# EAGLE design Tag-Deconnector (EAGLE 9.4.2)
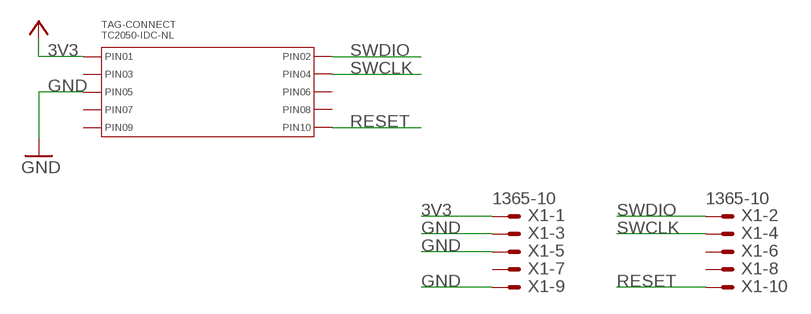
[diagram p0: schematic, sheet 1]

## Parts
TAG-CONNECT  TC2050-IDC-NL  CON_02X05_TC2050-IDC-NL  [TC2050-IDC-NL]
X1  1365-10  [1365-10]

## Nets
3V3: TAG-CONNECT.P$1(PIN1) X1.1 ; supply symbol labelled +3V3
GND: TAG-CONNECT.P$5(PIN5) X1.3 X1.5 X1.9
RESET: TAG-CONNECT.P$10(PIN10) X1.10
SWCLK: TAG-CONNECT.P$4(PIN4) X1.4
SWDIO: TAG-CONNECT.P$2(PIN2) X1.2
Unconnected: TAG-CONNECT.P$3(PIN3) TAG-CONNECT.P$6(PIN6) TAG-CONNECT.P$7(PIN7) TAG-CONNECT.P$8(PIN8) TAG-CONNECT.P$9(PIN9) X1.6 X1.7 X1.8

## Library data of the parts
TAG-CONNECT = MF_Connectors:CON_02X05: Library: MF_Connectors Description: Header Connector with 10 Positions and 02 Rows. Use the LABEL Attribute to label the pin on the schematic and PCB. You can remove the attributes on the PCB by using the SMASH function on the part and then deleting the text.; HOUSEPART: NO; MPN: TC2050-IDC-NL; POPULATE: 0; URL: http://www.tag-connect.com/Materials/TC2050-IDC-NL%20Datasheet.pdf
X1 = con-leotronics:1365-10: DUAL ROW STRAIGHT HEADER 1364 SERIES. 1.27mm x 1.27mm. Without Fixing Post. SMT Source: http://www.leotronics.co.uk/Conexcon/Data%20Sheets/sec.%20A/1364ing.pdf; OC_FARNELL: unknown; OC_NEWARK: unknown

## Board
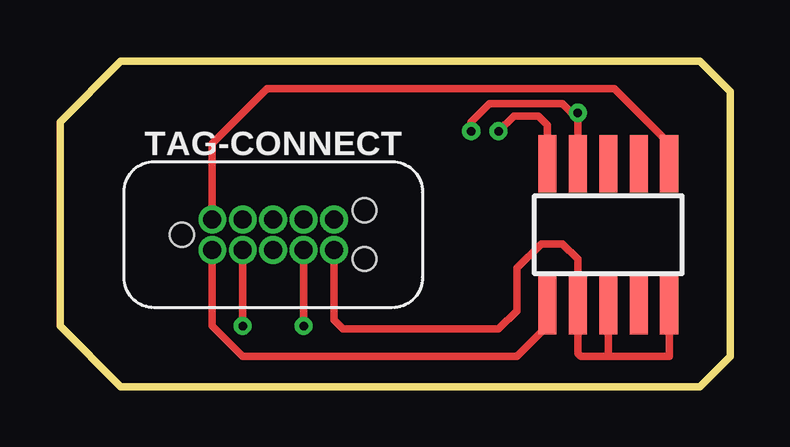
[diagram p1: board, top side]
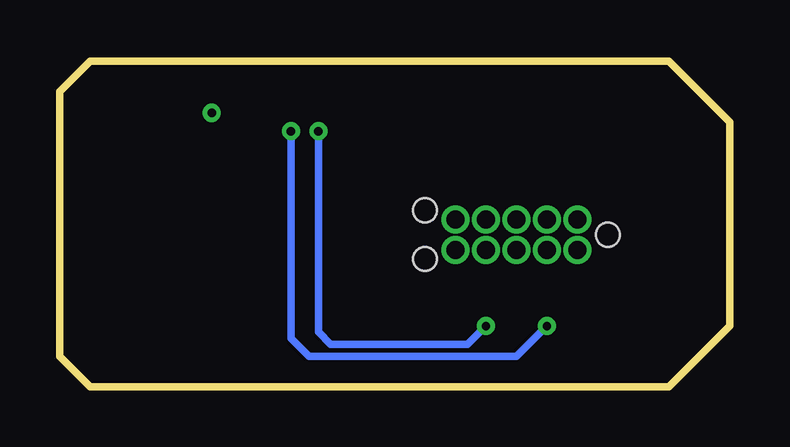
[diagram p2: board, bottom side, seen from below]

Size 27.92 x 13.64 mm. Coordinates in mm from the lower left corner, seen from the top.
Outline: 0,11.1 0,2.54 2.54,0 26.65,0 27.92,1.27 27.92,12.37 26.65,13.64 2.54,13.64 0,11.1
Copper layers (1*16): Top 0.035mm / dielectric 1.5mm / Bottom 0.035mm
Design rules "default": minimum track width 6mil, minimum drill 0.35mm, track to track 6mil, track to pad 6mil, pad to pad 6mil, via to via 6mil, smd to smd 6mil, copper to edge 40mil, drill to drill 6mil, minimum pad ring 10mil, minimum via ring 8mil, stop-mask expansion 4mil, vias tented up to drill 0mil, thermal gap 10mil
Milling: 8 lines

### Footprints (pad centres in the part's own frame; a part is rotated, then mirrored left to right if it is on the bottom)
TC2050-IDC-NL = smd 0.787 x 0.787: P$1 -2.54,-0.635; P$2 -1.27,-0.635; P$3 0,-0.635; P$4 1.27,-0.635; P$5 2.54,-0.635; P$6 2.54,0.635; P$7 1.27,0.635; P$8 0,0.635; P$9 -1.27,0.635; P$10 -2.54,0.635 | hole 0.991: 3.81,1.016; 3.81,-1.016; -3.81,0
1365-10 = smd 0.76 x 2.4: 1 -2.54,-2.95; 2 -2.54,2.95; 3 -1.27,-2.95; 4 -1.27,2.95; 5 0,-2.95; 6 0,2.95; 7 1.27,-2.95; 8 1.27,2.95; 9 2.54,-2.95; 10 2.54,2.95

### Placement (x,y rotation side)
TAG-CONNECT  8.89,6.35 0 top
X1  22.86,6.35 0 top

### Tracks (layer width: path | path; a pad name or v marks a point on that pad's centre or on a via)
3V3  (via drill 0.75)
  Top 0.305: TAG-CONNECT.P$1 6.35,2.54 7.62,1.27 19.05,1.27 20.32,2.54 X1.1
  other vias: 6.35,5.71
GND  (via drill 0.75)
  Top 0.305: 21.59,3.17 21.59,1.39 21.71,1.27 22.86,1.27 | 21.59,3.17 X1.3 | 22.86,1.27 X1.5 | 22.86,1.27 25.4,1.27 X1.9 | TAG-CONNECT.P$5 11.43,2.79 11.81,2.41 18.29,2.41 19.05,3.17 19.05,4.95 20.07,5.97 20.95,5.97 21.59,5.33 21.59,3.17
  other vias: 11.43,5.71
N$1  (via drill 0.75)
  other vias: 8.89,5.71
N$2  (via drill 0.75)
  other vias: 7.62,6.99
N$3  (via drill 0.75)
  other vias: 8.89,6.99
N$4  (via drill 0.75)
  other vias: 10.16,6.99
N$5  (via drill 0.75)
  other vias: 11.43,6.99
RESET  (via drill 0.75)
  Top 0.305: v6.35,6.99 6.35,10.16 8.64,12.45 23.11,12.45 25.4,10.16 X1.10
SWCLK  (via drill 0.35, 0.75)
  Top 0.305: TAG-CONNECT.P$4 v10.16,2.54 | X1.4 v21.59,11.43 21.34,11.43 20.95,11.81 17.91,11.81 17.14,11.05 v17.14,10.67
  Bottom 0.305: v17.14,10.67 17.14,2.29 16.64,1.78 10.92,1.78 v10.16,2.54
  other vias: 10.16,5.71
SWDIO  (via drill 0.35, 0.75)
  Top 0.305: 20.32,10.16 X1.2 20.32,10.92 19.94,11.3 18.92,11.3 v18.29,10.67 | v7.62,2.54 TAG-CONNECT.P$2
  Bottom 0.305: v7.62,2.54 8.89,1.27 17.53,1.27 18.29,2.03 v18.29,10.67
  other vias: 7.62,5.71